# Altium schematic sheet foldback.SchDoc
size Letter
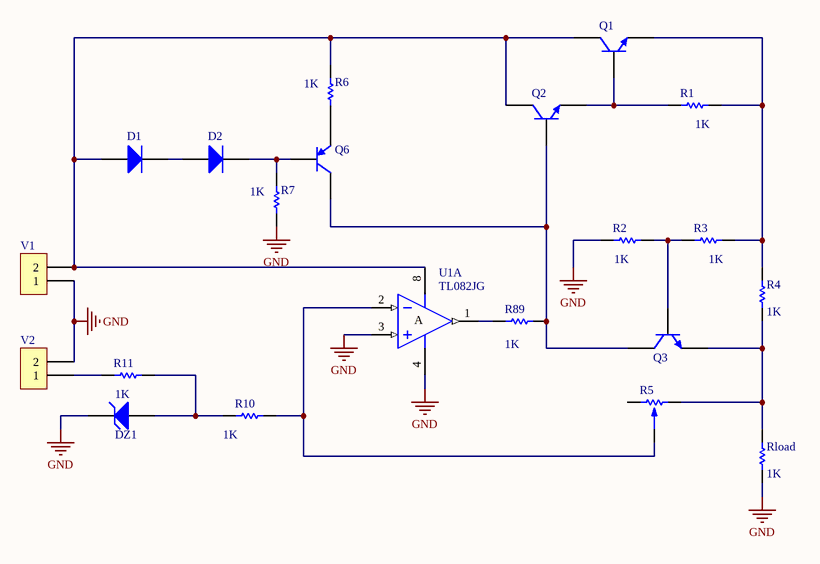
[diagram p0: foldback.SchDoc]

## Parts
D1  Diode 1N914  [DO-35]  (value not drawn)
D2  Diode 1N914  [DO-35]  (value not drawn)
DZ1  D Zener  [DIODE-0.7]  (value not drawn)
Q1  NPN  [TO-226-AA]  (value not drawn)
Q2  NPN  [TO-226-AA]  (value not drawn)
Q3  NPN  [TO-226-AA]  (value not drawn)
Q6  PNP  [SOT-23B_N]  (value not drawn)
R1  value 1K  [AXIAL-0.3]  (hidden comment: Res1)
R2  value 1K  [AXIAL-0.3]  (hidden comment: Res1)
R3  value 1K  [AXIAL-0.3]  (hidden comment: Res1)
R4  value 1K  [AXIAL-0.3]  (hidden comment: Res1)
R5  PRESET  [PRESET H]  (value not drawn)
R6  value 1K  [AXIAL-0.3]  (hidden comment: Res1)
R7  value 1K  [AXIAL-0.3]  (hidden comment: Res1)
R10  value 1K  [AXIAL-0.3]  (hidden comment: Res1)
R11  value 1K  [AXIAL-0.3]  (hidden comment: Res1)
R89  value 1K  [AXIAL-0.3]  (hidden comment: Res1)
Rload  value 1K  [AXIAL-0.3]  (hidden comment: Res1)
U1  TL082JG  [JG008]  (part A of 2)
V1  BORNERA 2  [BORNERA2]  (value not drawn)
V2  BORNERA 2  [BORNERA2]  (value not drawn)

## Nets
GND: DZ1.2(K) R2.2 R7.1 Rload.1 U1.3(IN+) U1.4(V-) V1.1 V2.2
NetD1_1: D1.1(A) Q1.1(C) Q2.1(C) R6.2 U1.8(V+) V1.2
NetD1_2: D1.2(K) D2.1(A)
NetD2_2: D2.2(K) Q6.2(B) R7.2
NetDZ1_1: DZ1.1(A) R10.1 R11.2
NetQ1_2: Q1.2(B) Q2.3(E) R1.2
NetQ1_3: Q1.3(E) R1.1 R3.1 R4.1
NetQ2_2: Q2.2(B) Q3.1(C) Q6.1(C) R89.2
NetQ3_2: Q3.2(B) R2.1 R3.2
NetQ3_3: Q3.3(E) R4.2 R5.1 Rload.2
NetQ6_3: Q6.3(E) R6.1
NetR5_2: R5.2 R10.2 U1.2(IN-)
NetR11_1: R11.1 V2.1
NetR89_1: R89.1 U1.1(OUT)

Not connected (* = marked no-connect by the designer): R5 3

## Notes on the sheet
- (in symbol TL082JG, part A) A

## Library data of the parts
D1 D2 = Diode 1N914: High Conductance Fast Diode; Published: 8-Jun-2000; LatestRevisionDate: 17-Jul-2002; LatestRevisionNote: Re-released for DXP Platform.; DatasheetVersion: 1997; PackageReference: DO-35; Publisher: Altium Limited; PackageDescription: Diode, Axial; Body 3.8 x 1.9 mm (LxDia. max), Lead Dia. 0.53 mm (max); Code_JEDEC: DO-204-AH; ComponentLink1Description: Manufacturer Link; ComponentLink1URL: http://www.fairchildsemi.com/; ComponentLink2Description: Datasheet; ComponentLink2URL: http://www.fairchildsemi.com/ds/1N%2F1N4448.pdf
DZ1 = D Zener: Zener Diode; Published: 8-Jun-2000; LatestRevisionDate: 17-Jul-2002; LatestRevisionNote: Re-released for DXP Platform.; PackageReference: DIODE-0.7; Publisher: Altium Limited; PackageDescription: Diode, Thru-Hole; 2 Leads; 0.7 in Pin Spacing
Q1-Q3 = NPN: NPN Bipolar Transistor; Published: 8-Jun-2000; LatestRevisionDate: 17-Jul-2002; LatestRevisionNote: Re-released for DXP Platform.; PackageReference: TO-226-AA; Publisher: Altium Limited; PackageDescription: TO, Flat Index; 3 In-Line, Axial Leads; Body Dia. 4.8mm; Leads 0.55 x 0.51 mm (max); Code_JEDEC: TO-226-AA
Q6 = PNP: PNP Bipolar Transistor; Published: 8-Jun-2000; LatestRevisionDate: 29-May-2009; LatestRevisionNote: IPC-7351 Footprint Added.; PackageVersion: Aug-1999; PackageReference: SOT-23B; Publisher: Altium Limited; PackageDescription: 3-Pin SOT-23 Package 0.95 mm Pitch, 2.4 mm Lead Span
R1-R4 R6 R7 R10 R11 R89 Rload = Res1: Resistor; Published: 8-Jun-2000; LatestRevisionDate: 17-Jul-2002; LatestRevisionNote: Re-released for DXP Platform.; PackageReference: AXIAL-0.3; Publisher: Altium Limited; PackageDescription: Axial Device, Thru-Hole; 2 Leads; 0.3 in Pin Spacing
U1 = TL082JG: JFET-Input Operational Amplifier; Published: 16-Jan-2001; LatestRevisionDate: 04-Mar-2005; LatestRevisionNote: Stylized 3D Model Added.; DatasheetVersion: Feb-1999; PackageVersion: Jan-1995; PackageReference: JG008; Publisher: Altium Limited; PackageDescription: DIP; 8 Leads; Row Spacing 7.62 mm; Pitch 2.54 mm; ComponentLink1Description: Manufacturer Link; ComponentLink1URL: http://www.ti.com/; ComponentLink2Description: Datasheet; ComponentLink2URL: http://www-s.ti.com/sc/ds/tl082.pdf